# Altium schematic sheet H-bridge_test.SchDoc
size 292 x 193 mm; Author: Power Lin; SheetNumber: 1; SheetTotal: 1; Website: wiki-power.com
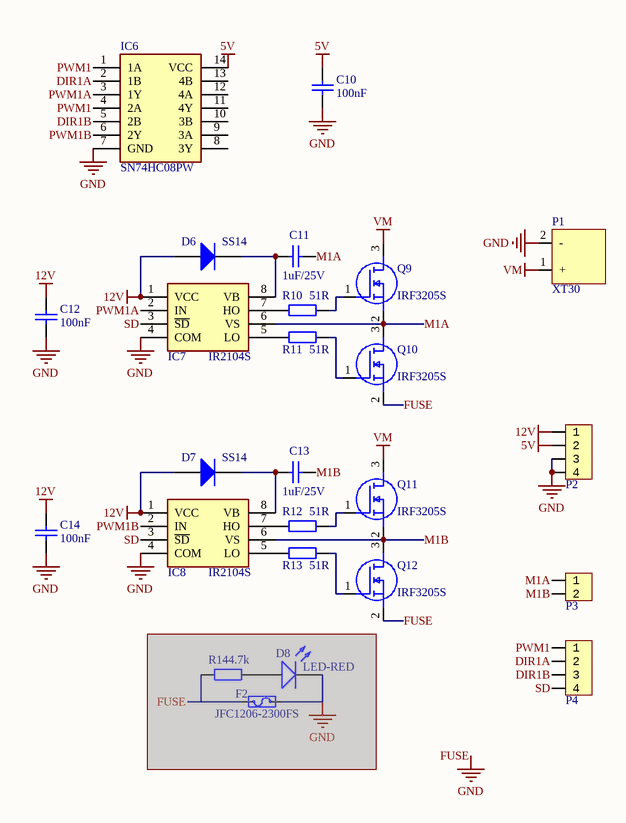
[diagram p0: H-bridge_test.SchDoc]

## Parts
C10  100nF  [CAP-0603]
C11  1uF/25V  [CAP-0603]
C12  100nF  [CAP-0603]
C13  1uF/25V  [CAP-0603]
C14  100nF  [CAP-0603]
D6  SS14  [DO-214AC_SMA]
D7  SS14  [DO-214AC_SMA]
D8  LED-RED  [LED-0603]  (masked out: inside a compile mask, not in the netlist)
F2  JFC1206-2300FS  [FUSE_1206]  (masked out: inside a compile mask, not in the netlist)
IC6  SN74HC08PW  [TSSOP14]
IC7  IR2104S  [SOIC_8]
IC8  IR2104S  [SOIC_8]
P1  XT30  [XT60PW-M]
P2  HDR1x4_2.54  [HDR1x4_2.54_180]  (value not drawn)
P3  HDR1x2_2.54  [HDR1X2_2.54_180]  (value not drawn)
P4  HDR1x4_2.54  [HDR1x4_2.54_180]  (value not drawn)
Q9  IRF3205S  [D2PAK-3]
Q10  IRF3205S  [D2PAK-3]
Q11  IRF3205S  [D2PAK-3]
Q12  IRF3205S  [D2PAK-3]
R10  51R  [R-0603]
R11  51R  [R-0603]
R12  51R  [R-0603]
R13  51R  [R-0603]
R14  4.7k  [R-0603]  (masked out: inside a compile mask, not in the netlist)

## Nets
5V: C10.2 IC6.14(VCC) P2.2
12V: C12.2 C14.2 D6.1(A) D7.1(A) IC7.1(VCC) IC8.1(VCC) P2.1
FUSE: C10.1 C12.1 C14.1 IC6.7(GND) IC7.4(COM) IC8.4(COM) P1.2(-) P2.3 P2.4 Q10.2(S) Q12.2(S)  [also labelled GND]
VM: P1.1(+) Q9.3(D) Q11.3(D)
DIR1A: IC6.2(1B) P4.2
DIR1B: IC6.5(2B) P4.3
M1A: C11.2 IC7.6(VS) P3.1 Q9.2(S) Q10.3(D)
M1B: C13.2 IC8.6(VS) P3.2 Q11.2(S) Q12.3(D)
PWM1: IC6.1(1A) IC6.4(2A) P4.1
PWM1A: IC6.3(1Y) IC7.2(IN)
PWM1B: IC6.6(2Y) IC8.2(IN)
SD: IC7.3(~{SD}) IC8.3(~{SD}) P4.4
NetC11_1: C11.1 D6.2(K) IC7.8(VB)
NetC13_1: C13.1 D7.2(K) IC8.8(VB)
NetIC7_5: IC7.5(LO) R11.1
NetIC7_7: IC7.7(HO) R10.1
NetIC8_5: IC8.5(LO) R13.1
NetIC8_7: IC8.7(HO) R12.1
NetQ9_1: Q9.1(G) R10.2
NetQ10_1: Q10.1(G) R11.2
NetQ11_1: Q11.1(G) R12.2
NetQ12_1: Q12.1(G) R13.2

Not connected (* = marked no-connect by the designer): IC6 8(3Y) 9(3A) 10(3B) 11(4Y) 12(4A) 13(4B)

## Notes on the sheet
- Author
- DocumentName
- ModifiedDate
- ProjectName
- SheetNumber
- SheetTotal
- Website
- Revision

## Library data of the parts
C10-C14 = CAP: 贴片电容; ComponentLink1Description: 供应商链接; ComponentLink1URL: http://www.szlcsc.com/product/details_53938.html; Package: 0402; Supplier: LC; SuppliersPartNumber: C52923
D6 D7 = DIODE: 二极管; ComponentLink1Description: 供应商链接; ComponentLink1URL: http://www.szlcsc.com/product/details_23178.html; Package: SMA(DO-214AC); Supplier: LC; SuppliersPartNumber: C22452
D8 = LED: 发光二极管; pin to pad: A>1 K>2; ComponentLink1Description: 供应商链接; ComponentLink1URL: http://www.szlcsc.com/product/details_2663.html; Package: 0603; Supplier: LC; SuppliersPartNumber: C2290
F2 = Fuse: 一次性贴片保险丝
IC6 = SN74HC08PW: Integrated Circuit; Manufacturer_Name: Texas Instruments; Manufacturer_Part_Number: SN74HCT08PW; Datasheet Link: http://www.ti.com/lit/gpn/SN74HCT08; Height: 1.2mm; Mouser Part Number: 595-SN74HCT08PW; Mouser Price/Stock: https://www.mouser.co.uk/ProductDetail/Texas-Instruments/SN74HCT08PW?qs=7KMwW2o1%252BmRuz7pKtn1cmg%3D%3D; Arrow Part Number: SN74HCT08PW; Arrow Price/Stock: https://www.arrow.com/en/products/sn74hct08pw/texas-instruments
IC7 IC8 = IR2104S: Integrated Circuit; Manufacturer_Name: Infineon; Datasheet Link: http://www.infineon.com/dgdl/ir2104.pdf?fileId=5546d462533600a4015355c7c1c31671; Height: 1.75mm; Manufacturer_Part_Number: IR2104S
P1 = XT30/60
P2 P4 = HDR1x4_2.54: Header
P3 = HDR1x2_2.54: Header
Q9-Q12 = N-MOS: N 沟道 MOS; Manufacturer_Name: Nexperia; Manufacturer_Part_Number: SI2302DS; Datasheet Link: https://assets.nexperia.com/documents/data-sheet/SI2302DS.pdf; Height: 1.1mm; Mouser Part Number: N/A; Mouser Price/Stock: https://www.mouser.com/Search/Refine.aspx?Keyword=N%2FA; RS Part Number: 7983053P; RS Price/Stock: http://uk.rs-online.com/web/p/products/7983053P
R10-R14 = RES: 贴片电阻; Package: 0805; Supplier: LC; SuppliersPartNumber: C17798